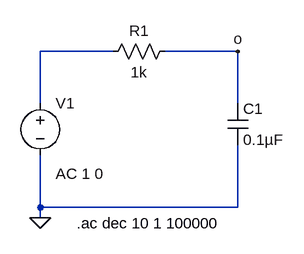
[diagram p0: schematic RC_circuit.asc]
RC_circuit.asc, the LTspice schematic file:
Version 4
SHEET 1 880 680
WIRE 80 48 -32 48
WIRE 272 48 160 48
WIRE -32 128 -32 48
WIRE 272 128 272 48
WIRE -32 288 -32 208
WIRE 272 288 272 192
WIRE 272 288 -32 288
WIRE -32 304 -32 288
FLAG -32 304 0
FLAG 272 48 o
SYMBOL voltage -32 112 R0
WINDOW 123 24 124 Left 2
WINDOW 39 0 0 Left 2
SYMATTR InstName V1
SYMATTR Value ""
SYMATTR Value2 AC 1 0
SYMBOL res 176 32 R90
WINDOW 0 0 56 VBottom 2
WINDOW 3 32 56 VTop 2
SYMATTR InstName R1
SYMATTR Value 1k
SYMBOL cap 256 128 R0
SYMATTR InstName C1
SYMATTR Value 0.1µF
TEXT 24 312 Left 2 !.ac dec 10 1 100000

The netlist it stands for:
* RC_circuit.asc
V1 N001 0 AC 1 0
R1 o N001 1k
C1 o 0 0.1µF
.ac dec 10 1 100000
.backanno
.end